# EAGLE design direct-drive-sampler (EAGLE 9.4.1)
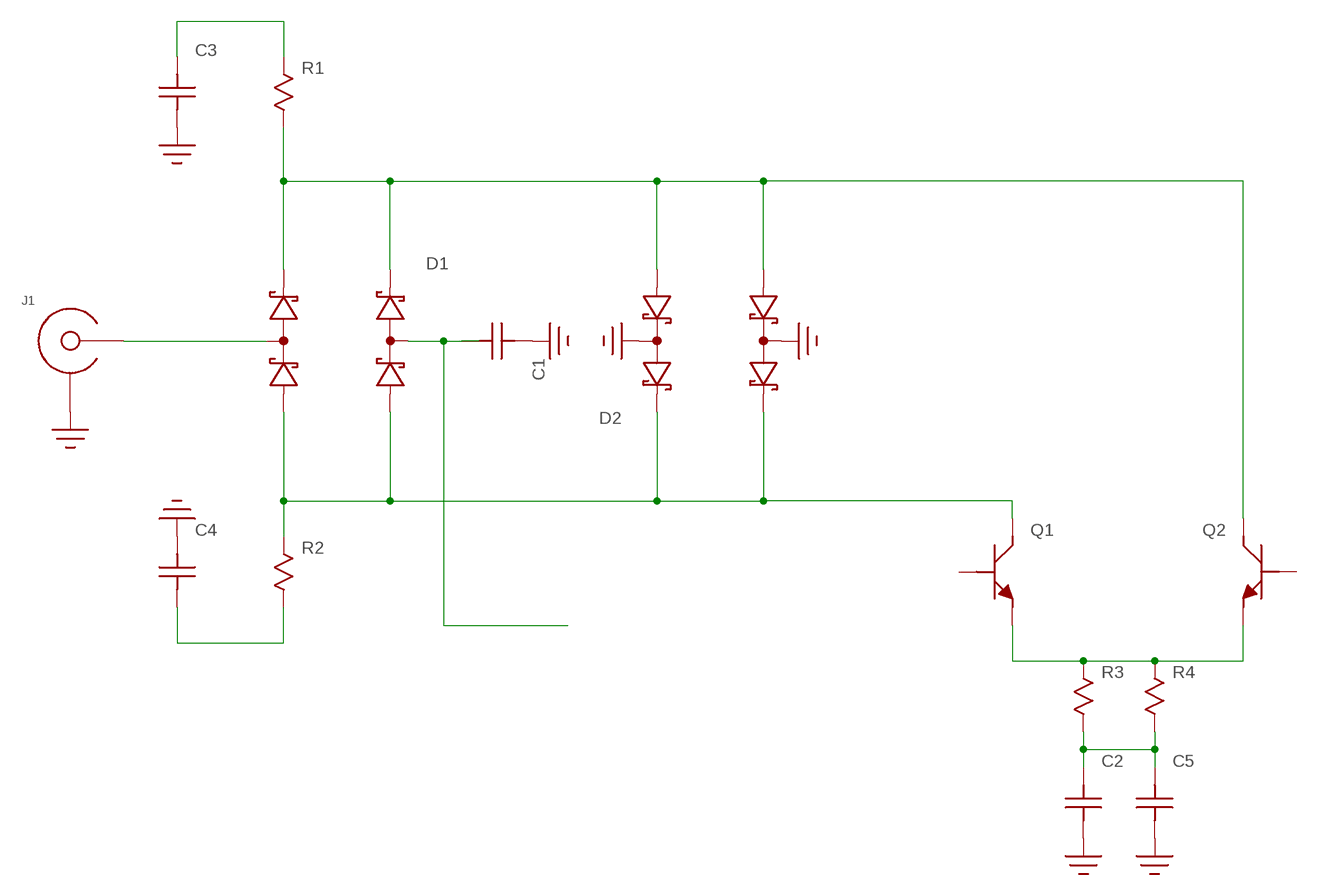
[diagram p0: schematic, sheet 1]

## Parts
C1  C  [C0402]
C2  C  [C0402]
C3  C  [C0402]
C4  C  [C0402]
C5  C  [C0402]
D1  SMS3923-081  [SC-88]
D2  SMS3923-081  [SC-88]
J1  SMA-EDGE-LAUNCH  [SMA_EDGE_LAUNCH_2L_4020_TAPER_FIXED]
Q1  NPN-BFP740  [SOT343]
Q2  NPN-BFP740  [SOT343]
R1  R0402  [0402]
R2  R0402  [0402]
R3  R0402  [0402]
R4  R0402  [0402]

## Nets
GND: C1.2 C2.1 C3.1 C4.2 C5.1 D2.2(COMMON0) D2.5(COMMON1) J1.BOTTOM_GND(SHIELD) J1.GND@1(SHIELD) J1.GND@2(SHIELD) J1.GND@3(SHIELD) J1.GND@4(SHIELD) J1.GND@5(SHIELD) J1.GND@6(SHIELD) J1.GND@7(SHIELD) J1.GND@8(SHIELD) J1.GND@14(SHIELD) J1.GND@15(SHIELD) J1.GND@16(SHIELD) J1.GND@17(SHIELD) J1.GND_PAD1(SHIELD) J1.GND_PAD2(SHIELD) J1.P$1(SHIELD) J1.P$2(SHIELD)
N$1: D1.5(COMMON1) J1.CENTER@1(CENTER) J1.P$3(CENTER)
N$2: C1.1 D1.2(COMMON0)
N$3: D1.3(CATHODE0) D1.4(CATHODE1) D2.1(ANODE0) D2.6(ANODE1) Q2.3(C) R1.2
N$4: D1.1(ANODE0) D1.6(ANODE1) D2.3(CATHODE0) D2.4(CATHODE1) Q1.3(C) R2.1
N$5: C3.2 R1.1
N$6: C4.1 R2.2
N$7: Q1.2(E) Q1.4(E) Q2.2(E) Q2.4(E) R3.1 R4.1
N$8: C2.2 C5.2 R3.2 R4.2
Unconnected: Q1.1(B) Q2.1(B)

## Library data of the parts
C1-C5 = yapo:C
D1 D2 = yapo:SMS3923-081
J1 = sma_footprint_2l:SMA-EDGE-LAUNCH
Q1 Q2 = yapo:NPN
R1-R4 = yapo:R

## Board
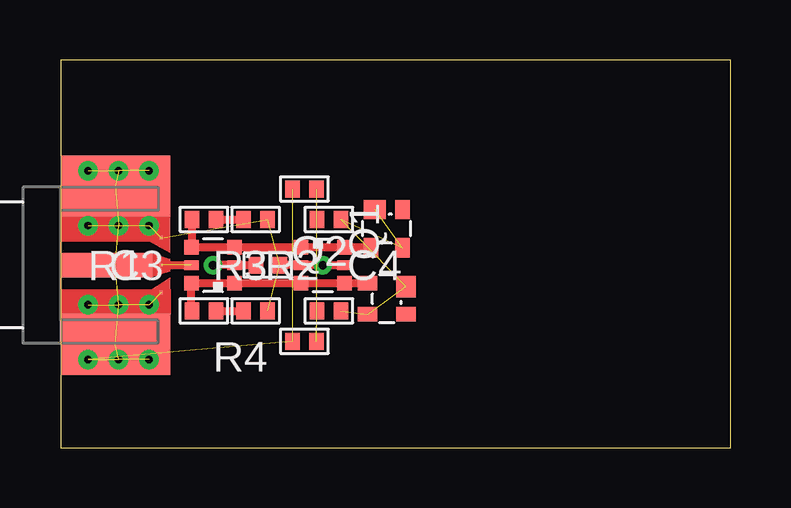
[diagram p1: board, top side]
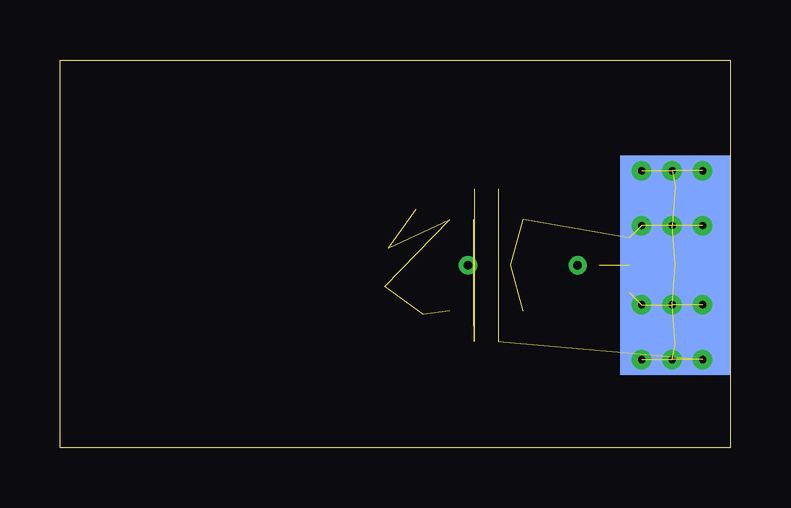
[diagram p2: board, bottom side, seen from below]

Size 27.92 x 16.18 mm. Coordinates in mm from the lower left corner, seen from the top.
Outline: 0,0 27.92,0 27.92,16.18 0,16.18 0,0
Copper layers (1*16): Top 0.035mm / dielectric 1.5mm / Bottom 0.035mm
Design rules "default": minimum track width 6mil, minimum drill 0.35mm, track to track 6mil, track to pad 6mil, pad to pad 6mil, via to via 6mil, smd to smd 6mil, copper to edge 40mil, drill to drill 6mil, minimum pad ring 10mil, minimum via ring 8mil, stop-mask expansion 4mil, vias tented up to drill 0mil, thermal gap 10mil

### Footprints (pad centres in the part's own frame; a part is rotated, then mirrored left to right if it is on the bottom)
C0402 = smd 0.6 x 0.7: 1 -0.5,0; 2 0.5,0
SC-88 = smd 0.6 x 0.6: 1 -0.9,0.75; 3 -0.9,-0.75; 4 0.9,-0.75; 6 0.9,0.75 | smd 0.6 x 0.4: 2 -0.9,0; 5 0.9,0
SMA_EDGE_LAUNCH_2L_4020_TAPER_FIXED = smd 4.572 x 9.144 bottom: BOTTOM_GND 2.286,0 | smd 3.81 x 1.016: CENTER@1 1.905,0 | drill 0.3: GND@1 1.143,3.937; GND@2 3.683,3.937; GND@3 1.143,1.651; GND@4 3.683,1.651; GND@5 1.143,-1.651; GND@6 3.683,-1.651; GND@7 1.143,-3.937; GND@8 3.683,-3.937; GND@14 2.413,3.937; GND@15 2.413,-3.937; GND@16 2.413,-1.651; GND@17 2.413,1.651 | smd 4.572 x 2.54: GND_PAD1 2.286,3.302; GND_PAD2 2.286,-3.302 | smd 0.127 x 0.127: P$1 4.191,1.143; P$2 4.191,-1.143; P$3 4.191,0
SOT343 = smd 0.6 x 0.8: 1 -0.65,-0.8; 3 0.65,0.8; 4 -0.65,0.8 | smd 0.9 x 0.8: 2 0.5,-0.8
0402 = smd 0.6 x 0.7: 1 -0.5,0; 2 0.5,0

### Placement (x,y rotation side)
C1  8.64,7.62 0 top
C2  10.16,4.45 0 top
C3  8.13,9.53 180 top
C4  8.13,5.71 0 top
C5  10.16,10.79 0 top
D1  6.35,7.62 180 top
D2  10.92,7.62 0 top
J1  0,7.62 0 top
Q1  13.59,6.22 90 top
Q2  13.59,9.14 180 top
R1  5.97,9.53 180 top
R2  5.97,5.71 0 top
R3  11.18,9.53 180 top
R4  11.18,5.71 180 top

### Tracks (layer width: path | path; a pad name or v marks a point on that pad's centre or on a via)
GND  (via drill 0.35)  (21 unrouted)
  Top 0.343: C1.2 D2.2 v10.92,7.62 D2.5
N$1  (1 unrouted)
  Top 0.343: J1.CENTER@1 D1.5
N$2  (via drill 0.35)
  Top 0.343: C1.1 D1.2 v6.35,7.62
N$3
  Top 0.343: Q2.3 12.94,8.37 D2.6 D2.1 D1.3 D1.4 5.47,8.37 R1.2
N$4
  Top 0.343: Q1.3 D2.4 D2.3 D1.1 D1.6 5.45,5.71 R2.1
N$5
  Top 0.343: R1.1 C3.2
N$6
  Top 0.343: R2.2 C4.1
N$7  (5 unrouted)
N$8  (3 unrouted)